# EAGLE design LED IoT Card (EAGLE 9.6.2)
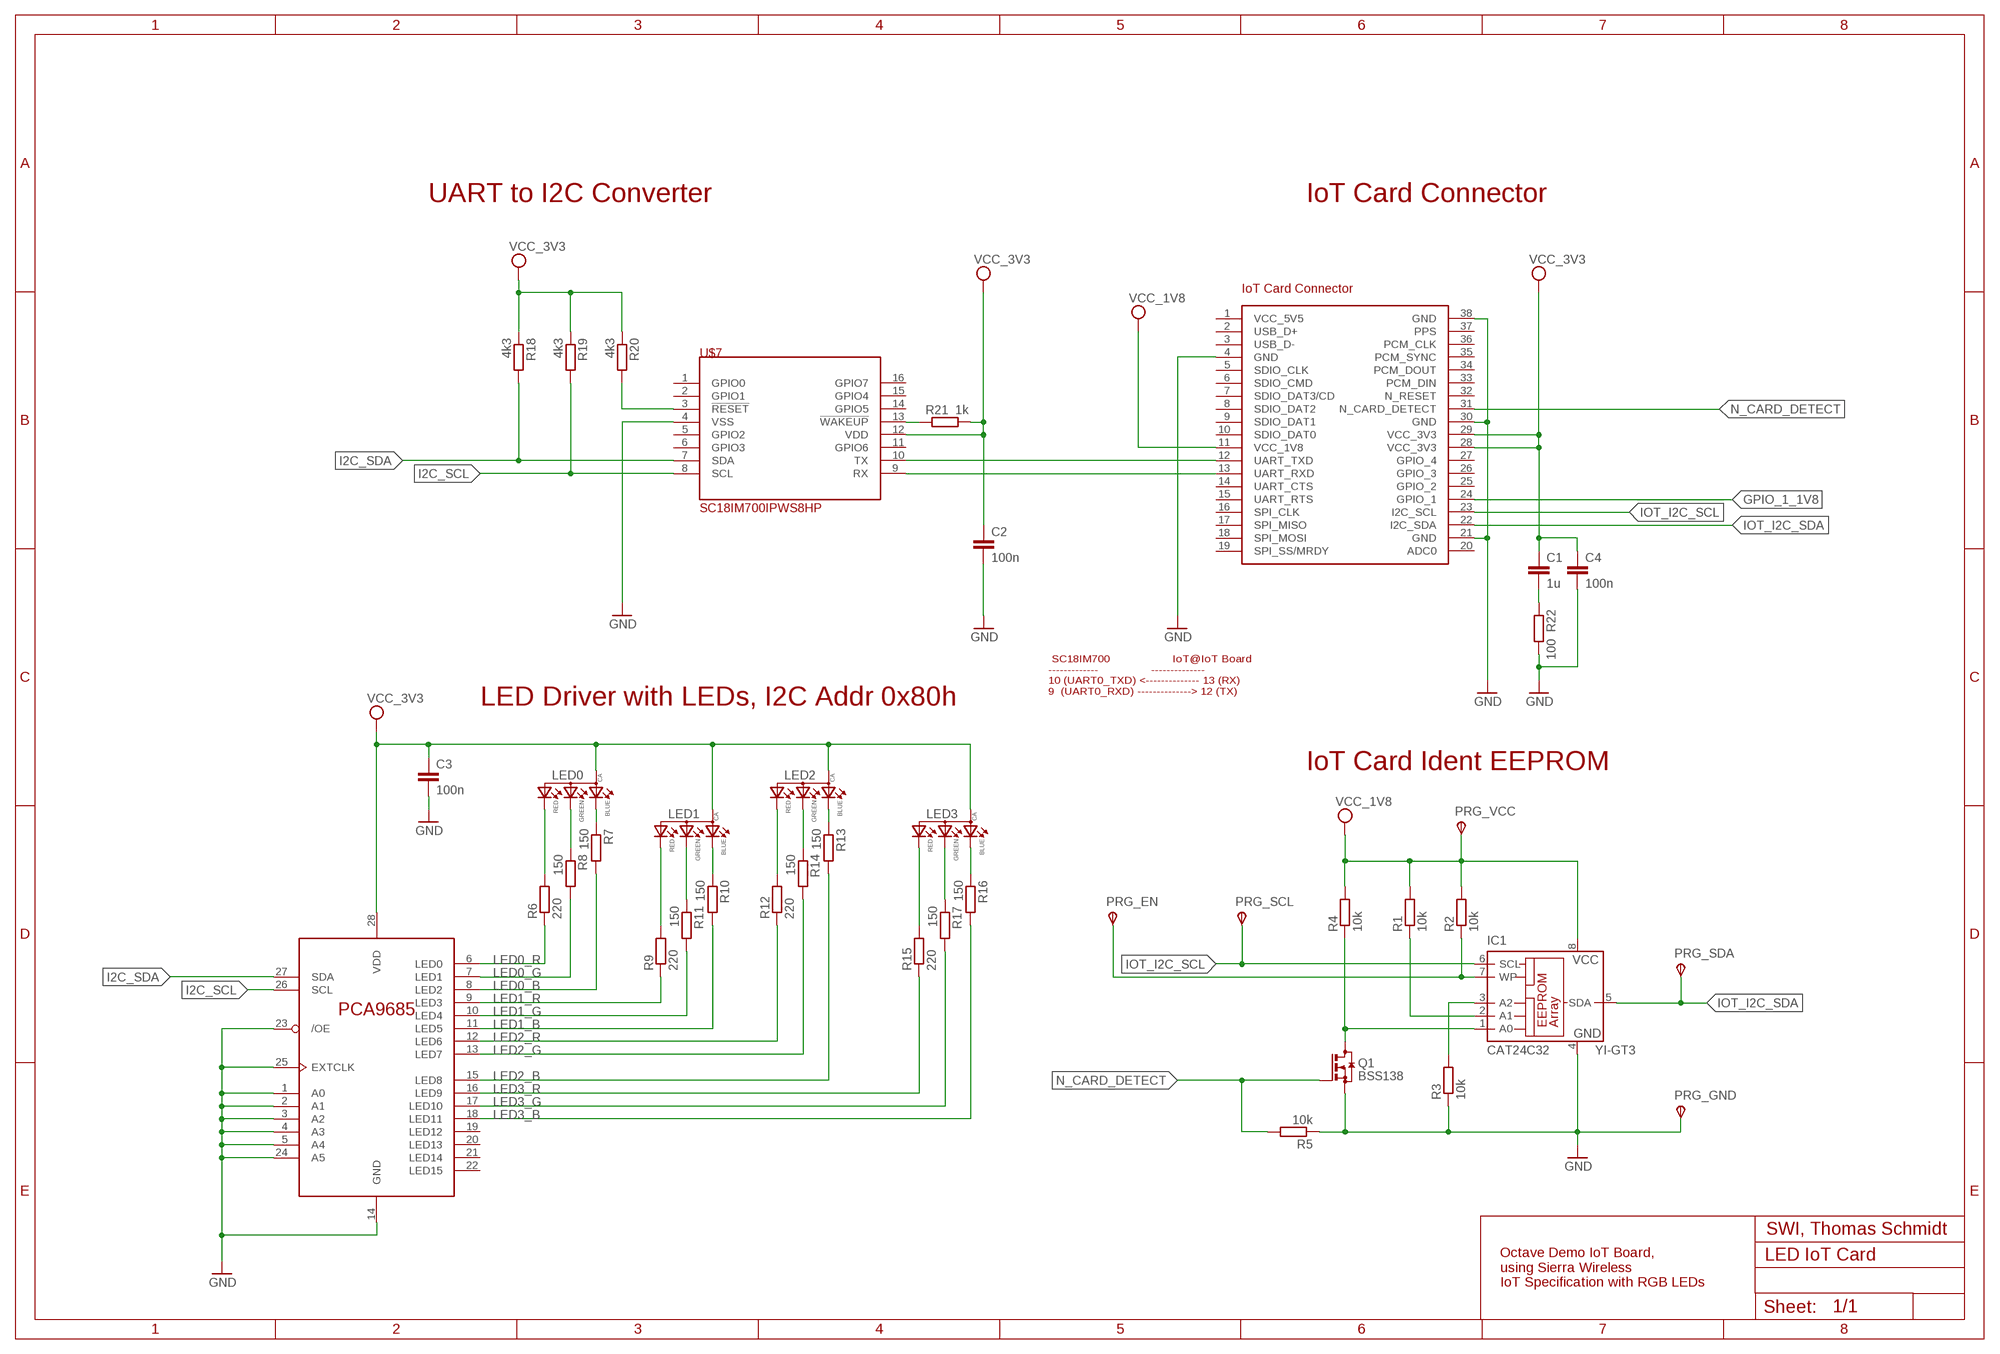
[diagram p0: schematic, sheet 1]

## Parts
C1  1u  C-EUC0805K  [C0805K]
C2  100n  C-EUC0603K  [C0603K]
C3  100n  C-EUC0603K  [C0603K]
C4  100n  C-EUC0603K  [C0603K]
IC1  CAT24C32 YI-GT3  24C64ST  [TSSOP8]
LED0  0.13_RGB_LEDPLCC  [P-LCC-4-3]
LED1  0.13_RGB_LEDPLCC  [P-LCC-4-3]
LED2  0.13_RGB_LEDPLCC  [P-LCC-4-3]
LED3  0.13_RGB_LEDPLCC  [P-LCC-4-3]
PRG_EN  TPSB1,27  [B1,27]
PRG_GND  TPSB1,27  [B1,27]
PRG_SCL  TPSB1,27  [B1,27]
PRG_SDA  TPSB1,27  [B1,27]
PRG_VCC  TPSB1,27  [B1,27]
Q1  BSS138  BSS123  [SOT23]
R1  10k  R-EU_R0402  [R0402]
R2  10k  R-EU_R0402  [R0402]
R3  10k  R-EU_R0402  [R0402]
R4  10k  R-EU_R0402  [R0402]
R5  10k  R-EU_R0402  [R0402]
R6  220  R-EU_R0402  [R0402]
R7  150  R-EU_R0402  [R0402]
R8  150  R-EU_R0402  [R0402]
R9  220  R-EU_R0402  [R0402]
R10  150  R-EU_R0402  [R0402]
R11  150  R-EU_R0402  [R0402]
R12  220  R-EU_R0402  [R0402]
R13  150  R-EU_R0402  [R0402]
R14  150  R-EU_R0402  [R0402]
R15  220  R-EU_R0402  [R0402]
R16  150  R-EU_R0402  [R0402]
R17  150  R-EU_R0402  [R0402]
R18  4k3  R-EU_R0402  [R0402]
R19  4k3  R-EU_R0402  [R0402]
R20  4k3  R-EU_R0402  [R0402]
R21  1k  R-EU_R0402  [R0402]
R22  100  R-EU_R0402  [R0402]
U$1  IOTLONG  [IOT_LONG]
U$2  PCA9685PW  [TSSOP28]
U$7  SC18IM700IPWS8HP  [TSSOP16]

## Nets
EEPROM_A0: IC1.1(A0) Q1.3(D) R4.1
EEPROM_A1: IC1.2(A1) R1.1
EEPROM_A2: IC1.3(A2) R3.2
EEPROM_WP: IC1.7(WP) PRG_EN.TP(PP) R2.1
GND: C2.2 C3.2 C4.2 IC1.4(GND) PRG_GND.TP(PP) Q1.2(S) R3.1 R5.1 R22.2 U$1.4(GND) U$1.21(GND) U$1.30(GND) U$1.38(GND) U$2.1(A0) U$2.2(A1) U$2.3(A2) U$2.4(A3) U$2.5(A4) U$2.14(GND) U$2.23(/OE) U$2.24(A5) U$2.25(EXTCLK) U$7.4(VSS)
GPIO_1_1V8: U$1.24(GPIO_1)
I2C_SCL: R19.2 U$2.26(SCL) U$7.8(SCL)
I2C_SDA: R18.2 U$2.27(SDA) U$7.7(SDA)
IOT_I2C_SCL: IC1.6(SCL) PRG_SCL.TP(PP) U$1.23(I2C_SCL)
IOT_I2C_SDA: IC1.5(SDA) PRG_SDA.TP(PP) U$1.22(I2C_SDA)
LED0_B: R7.2 U$2.8(LED2)
LED0_G: R8.2 U$2.7(LED1)
LED0_R: R6.1 U$2.6(LED0)
LED1_B: R10.2 U$2.11(LED5)
LED1_G: R11.2 U$2.10(LED4)
LED1_R: R9.1 U$2.9(LED3)
LED2_B: R13.2 U$2.15(LED8)
LED2_G: R14.2 U$2.13(LED7)
LED2_R: R12.1 U$2.12(LED6)
LED3_B: R16.2 U$2.18(LED11)
LED3_G: R17.2 U$2.17(LED10)
LED3_R: R15.1 U$2.16(LED9)
N$25: R20.2 U$7.3(!RESET)
N$26: R21.1 U$7.13(!WAKEUP)
N$27: C1.2 R22.1
N_CARD_DETECT: Q1.1(G) R5.2 U$1.31(N_CARD_DETECT)
RES_LED0_B: LED0.3(BLUE) R7.1
RES_LED0_G: LED0.2(GREEN) R8.1
RES_LED0_R: LED0.1(RED) R6.2
RES_LED1_B: LED1.3(BLUE) R10.1
RES_LED1_G: LED1.2(GREEN) R11.1
RES_LED1_R: LED1.1(RED) R9.2
RES_LED2_B: LED2.3(BLUE) R13.1
RES_LED2_G: LED2.2(GREEN) R14.1
RES_LED2_R: LED2.1(RED) R12.2
RES_LED3_B: LED3.3(BLUE) R16.1
RES_LED3_G: LED3.2(GREEN) R17.1
RES_LED3_R: LED3.1(RED) R15.2
SC18IM-RX_IOT-TX: U$1.12(UART_TXD) U$7.10(TX)
SC18IM-TX_IOT-RX: U$1.13(UART_RXD) U$7.9(RX)
VCC_1V8: IC1.8(VCC) PRG_VCC.TP(PP) R1.2 R2.2 R4.2 U$1.11(VCC_1V8)
VCC_3V3: C1.1 C2.1 C3.1 C4.1 LED0.4(ANODE) LED1.4(ANODE) LED2.4(ANODE) LED3.4(ANODE) R18.1 R19.1 R20.1 R21.2 U$1.28(VCC_3V3) U$1.29(VCC_3V3) U$2.28(VDD) U$7.12(VDD)
Unconnected: U$1.2(USB_D+) U$1.3(USB_D-) U$1.5(SDIO_CLK) U$1.6(SDIO_CMD) U$1.7(SDIO_DAT3/CD) U$1.8(SDIO_DAT2) U$1.9(SDIO_DAT1) U$1.10(SDIO_DAT0) U$1.14(UART_CTS) U$1.15(UART_RTS) U$1.16(SPI_CLK) U$1.17(SPI_MISO) U$1.18(SPI_MOSI) U$1.19(SPI_SS/MRDY) U$1.20(ADC0) U$1.25(GPIO_2) U$1.26(GPIO_3) U$1.27(GPIO_4) U$1.32(N_RESET) U$1.33(PCM_DIN) U$1.34(PCM_DOUT) U$1.35(PCM_SYNC) U$1.36(PCM_CLK) U$1.37(PPS) U$2.19(LED12) U$2.20(LED13) U$2.21(LED14) U$2.22(LED15) U$7.1(GPIO0) U$7.2(GPIO1) U$7.5(GPIO2) U$7.6(GPIO3) U$7.11(GPIO6) U$7.14(GPIO5) U$7.15(GPIO4) U$7.16(GPIO7)

## Notes on the sheet
- UART to I2C Converter | IoT Card Connector
- LED Driver with LEDs, I2C Addr 0x80h
- SC18IM700                   IoT@IoT Board
  -------------                --------------
  10 (UART0_TXD) <-------------- 13 (RX)  
  9  (UART0_RXD) --------------> 12 (TX)
- IoT Card Ident EEPROM
- SWI, Thomas Schmidt
- Octave Demo IoT Board, 
  using Sierra Wireless 
  IoT Specification with RGB LEDs

## Power pins joined to a net without a drawn wire
VCC_5V5: U$1.1(VCC_5V5)

## Library data of the parts
C1-C4 = rcl:C-EU: CAPACITOR, European symbol
IC1 = microchip:24*: Serial EEPROM I2C; MPN: CAT24C64YI-GT3; OC_FARNELL: 1718133; OC_NEWARK: 08R5418
LED0 LED1-LED3 = LEDs:0.13_RGB_LED: Everlight Red/Green/Blue LED 67-23/R6GHBHC-B01/2T || 67-23/R6GHBH-B01 Size 3.2*2.8*1.9mm Mounting Type SMD Full-Color LED PLCC4 Emitting Color Red/Green/Blue (620-625/530-535/470-475 nm) Chip Material AlGaInP/InGaN/InGaN Luminous Intensity 57-112/225-450/36-72 mcd Viewing Angle 120 deg Lens Type-Color Water Clear Forward Voltage 2.0/3.5/3.5 V Forward Current 10 mA Maximum Forward Voltage 2.4/3.9/3.9 V Maximum Forward Current 25/25/25 mA Min-Max Operating Temperature -40C to +85C Factory Pack 2000 pcs-Reel RoHS ✓; PROD_ID: DIO-12986
PRG_EN PRG_GND PRG_SCL PRG_SDA PRG_VCC = testpad:TPS: TEST PIN
Q1 = transistor-small-signal:BSS123: N-CHANNEL MOS FET
R1-R22 = rcl:R-EU_: RESISTOR, European symbol
U$1 = IoT Card:IOT: IoT Expansion Card The IoT Expansion Card form factor represents an open hardware standard for sensors, network adapters, and other IoT technologies that can be "plugged" into host applications (e.g. hardware development board) to provide new features and interfaces. As a family, IoT Expansion Cards share a standardized footprint and pinout, with several interfaces to support various IoT technologies. Please check as well: http://mangoh.io/uploaded-documents/Reference/IoT%20Cards/IoT%20Card%20Specification/4117166_IoT%20Expansion%20Card%20Design%20Specification_r8.pdf
U$2 = i2c-led-controller:PCA9685
U$7 = SC18IM700IPW:SC18IM700IPW

## Board
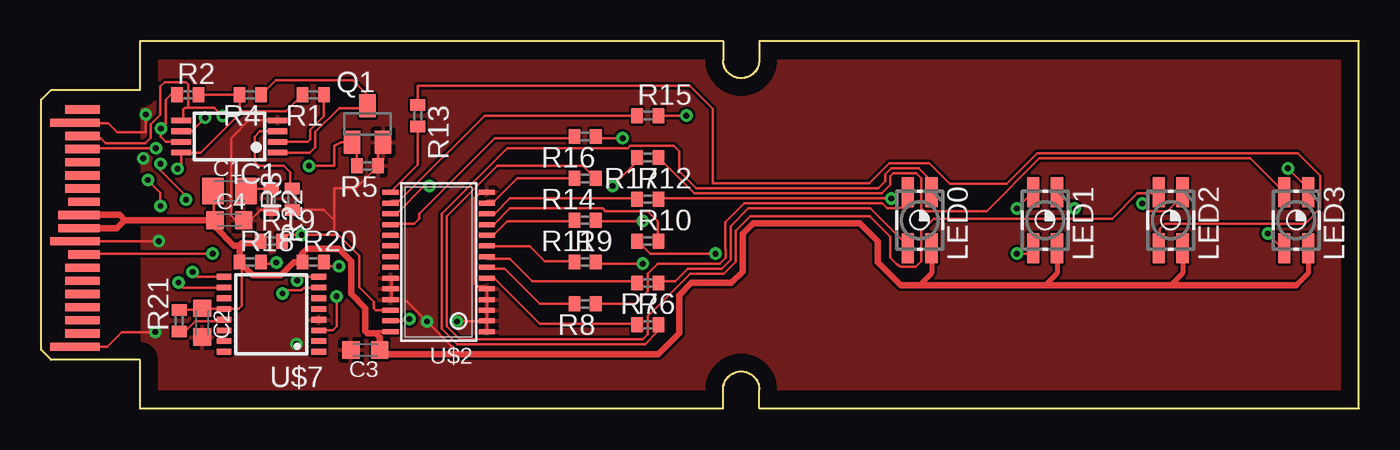
[diagram p1: board, top side]
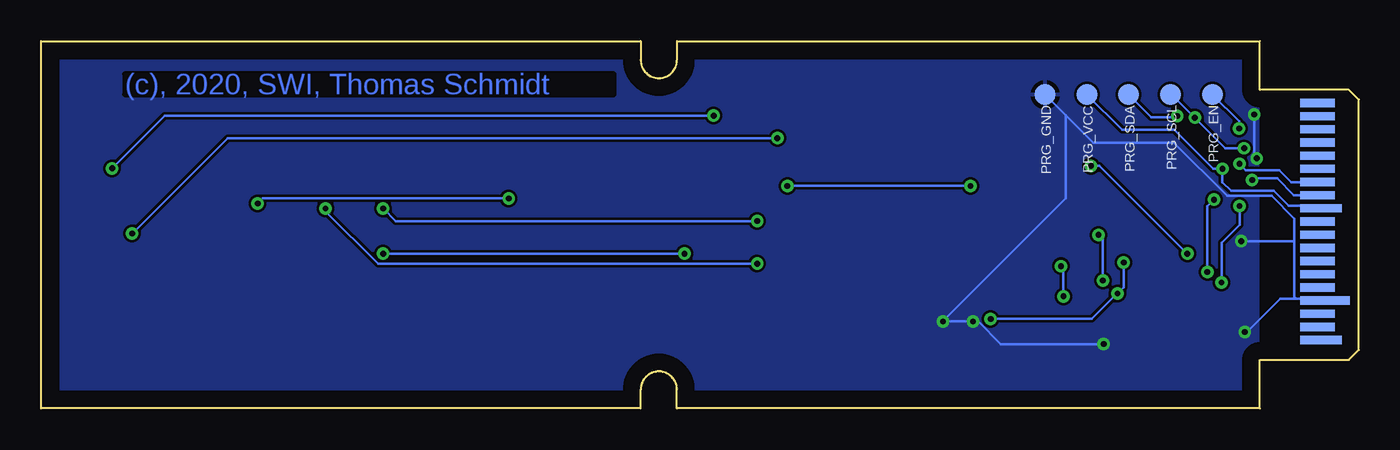
[diagram p2: board, bottom side, seen from below]

Size 80 x 22.3 mm. Coordinates in mm from the lower left corner, seen from the top.
Copper layers (1*16): Top 0.035mm / dielectric 1.5mm / Bottom 0.035mm
Design rules "default": minimum track width 6mil, minimum drill 0.35mm, track to track 6mil, track to pad 6mil, pad to pad 6mil, via to via 6mil, smd to smd 6mil, copper to edge 40mil, drill to drill 6mil, minimum pad ring 10mil, minimum via ring 8mil, stop-mask expansion 4mil, vias tented up to drill 0mil, thermal gap 10mil
tKeepout: area 6.1,20.3 to 41.1,22.3; area 6.1,0.3 to 41.1,2.3

### Footprints (pad centres in the part's own frame; a part is rotated, then mirrored left to right if it is on the bottom)
C0805K = smd 1.3 x 1.6: 1 -1,0; 2 1,0
C0603K = smd 1.05 x 1.08: 1 -0.875,0; 2 0.875,0
TSSOP8 = smd 0.35 x 1.2: 1 -0.975,-2.925; 2 -0.325,-2.925; 3 0.325,-2.925; 4 0.975,-2.925; 5 0.975,2.925; 6 0.325,2.925; 7 -0.325,2.925; 8 -0.975,2.925
P-LCC-4-3 = smd 0.75 x 1.8: 1 0.725,1.7; 2 -0.725,1.7; 3 -0.725,-1.7; 4 0.725,-1.7
B1,27 = smd 1.27 x 1.27: TP 0,0
SOT23 = smd 1 x 1.4: 1 -0.95,-1.1; 2 0.95,-1.1; 3 0,1.1
R0402 = smd 0.7 x 0.9: 1 -0.65,0; 2 0.65,0
IOT_LONG = smd 2.5 x 0.5 bottom: 1 2.3,4.15; 11 2.3,12.15 | smd 2.1 x 0.5 bottom: 2 2.5,4.95; 3 2.5,5.75; 5 2.5,7.35; 6 2.5,8.15; 7 2.5,8.95; 8 2.5,9.75; 9 2.5,10.55; 10 2.5,11.35; 12 2.5,12.95; 13 2.5,13.75; 14 2.5,14.55; 15 2.5,15.35; 16 2.5,16.15; 17 2.5,16.95; 18 2.5,17.75; 19 2.5,18.55 | smd 3 x 0.5 bottom: 4 2.05,6.55 | smd 2.1 x 0.5: 20 2.5,18.15; 22 2.5,16.55; 23 2.5,15.75; 24 2.5,14.95; 25 2.5,14.15; 26 2.5,13.35; 32 2.5,8.55; 33 2.5,7.75; 34 2.5,6.95; 35 2.5,6.15; 36 2.5,5.35; 37 2.5,4.55 | smd 3 x 0.5: 21 2.05,17.35; 30 2.05,10.15; 38 2.05,3.75 | smd 1.9 x 0.5: 27 2.6,12.55; 31 2.6,9.35 | smd 2.5 x 0.5: 28 2.3,11.75; 29 2.3,10.95
TSSOP28 = smd 0.305 x 0.991: 1 -4.225,-2.918; 2 -3.575,-2.918; 3 -2.925,-2.918; 4 -2.275,-2.918; 5 -1.625,-2.918; 6 -0.975,-2.918; 7 -0.325,-2.918; 8 0.325,-2.918; 9 0.975,-2.918; 10 1.625,-2.918; 11 2.275,-2.918; 12 2.925,-2.918; 13 3.575,-2.918; 14 4.225,-2.918; 15 4.225,2.918; 16 3.575,2.918; 17 2.925,2.918; 18 2.275,2.918; 19 1.625,2.918; 20 0.975,2.918; 21 0.325,2.918; 22 -0.325,2.918; 23 -0.975,2.918; 24 -1.625,2.918; 25 -2.275,2.918; 26 -2.925,2.918; 27 -3.575,2.918; 28 -4.225,2.918
TSSOP16 = smd 0.9 x 0.35: 1 -2.875,2.275; 2 -2.875,1.625; 3 -2.875,0.975; 4 -2.875,0.325; 5 -2.875,-0.325; 6 -2.875,-0.975; 7 -2.875,-1.625; 8 -2.875,-2.275; 9 2.875,-2.275; 10 2.875,-1.625; 11 2.875,-0.975; 12 2.875,-0.325; 13 2.875,0.325; 14 2.875,0.975; 15 2.875,1.625; 16 2.875,2.275

### Placement (x,y rotation side)
C1  11.43,13.21 0 top
C2  9.78,5.21 270 top
C3  19.69,3.56 180 top
C4  11.43,11.43 0 top
IC1  11.43,16.51 90 top
LED0  53.34,11.43 0 top
LED1  60.96,11.43 0 top
LED2  68.58,11.43 0 top
LED3  76.2,11.43 0 top
PRG_EN  8.89,19.05 0 bottom
PRG_GND  19.05,19.06 0 bottom
PRG_SCL  11.43,19.05 0 bottom
PRG_SDA  13.97,19.05 0 bottom
PRG_VCC  16.5,19.05 0 bottom
Q1  19.81,17.27 0 top
R1  16.51,19.05 180 top
R2  8.89,19.05 0 top
R3  15.24,12.7 90 top
R4  12.7,19.05 180 top
R5  19.81,14.73 180 top
R6  36.83,5.08 0 top
R7  36.83,7.62 180 top
R8  33.02,6.35 180 top
R9  33.02,8.89 0 top
R10  36.83,10.16 0 top
R11  33.02,11.43 180 top
R12  36.83,12.7 0 top
R13  22.86,17.78 270 top
R14  33.02,13.97 180 top
R15  36.83,17.78 0 top
R16  33.02,16.51 180 top
R17  36.83,15.24 180 top
R18  12.7,8.89 0 top
R19  13.97,10.16 0 top
R20  16.51,8.89 0 top
R21  8.38,5.33 90 top
R22  13.97,12.7 270 top
U$1  0,0 0 top
U$2  24.13,8.89 90 top
U$7  13.97,5.71 180 top

### Tracks (layer width: path | path; a pad name or v marks a point on that pad's centre or on a via)
EEPROM_A0
  Top 0.152: IC1.1 16.3,15.54 16.64,15.88 16.64,16.79 18.09,18.24 19.81,18.24 Q1.3 19.81,19.05 18.93,19.93 14.23,19.93 R4.1
EEPROM_A1
  Top 0.152: IC1.2 16.19,16.19 16.33,16.33 16.33,16.92 17.16,17.74 R1.1
EEPROM_A2
  Top 0.152: R3.2 15.11,13.48 15.11,14.35 14.73,14.73 13.21,14.73 12.95,14.99 12.95,16.51 13.28,16.84 IC1.3
EEPROM_WP  (via drill 0.35)
  Top 0.152: R2.1 7.87,19.05 7.57,18.75 7.57,17.3 v7.26,16.99 7.26,16.48 7.56,16.19 IC1.7
  Bottom 0.152: v7.26,16.99 7.26,17.42 PRG_EN.TP
GND  (via drill 0.35)
  Top 0.152: U$2.25 21.29,6.66 21.29,7.26 U$2.24 21.29,7.42 21.29,7.87 U$2.23 21.2,7.9 20.8,7.9 | 22.2,6.5 v23.42,5.28 24.94,3.76 | U$1.21 2.08,17.32 4.06,17.32 4.62,16.76 6.35,16.76 v6.35,17.85 | 17.78,11.43 17.78,13.36 19.09,13.36 R5.1 20.46,15.87 Q1.2 | 17.78,11.43 17.78,10.92 | U$2.1 27.08,4.67 27.08,5.28 U$2.2 | U$2.2 27.08,5.44 27.08,5.89 U$2.3 27.08,6.05 27.08,6.5 U$2.4 27.08,6.66 27.08,7.26 U$2.5 26.92,7.42 26.47,7.42 26.31,7.57 26.31,12.75 26.62,13.06 26.92,13.06 U$2.14 | 15.63,3.78 v15.49,3.91 15.65,3.91 | v7.14,10.16 2.08,10.16 U$1.30 | v25.25,5.28 26.92,5.28 U$2.2 | v6.93,4.64 4.89,4.64 4,3.75 U$1.38 | R22.2 13.32,12.05 12.7,11.43 12.46,11.43 12.27,11.62 C4.2 11.81,11.43 11.53,11.71 11.53,16.41 12.61,17.48 IC1.4 | R3.1 17.16,12.05 17.78,11.43
  Bottom 0.152: 3.91,10.16 3.91,6.76 3.81,6.66 | 3.91,10.16 3.91,11.53 5.28,12.9 8,12.9 11.24,16.14 16.13,16.14 PRG_GND.TP 17.78,17.79 17.78,12.75 v25.25,5.28 v23.42,5.28 23.11,5.28 21.74,3.91 v15.49,3.91 | 3.81,6.66 2.08,6.66 U$1.4 | 3.91,10.16 v7.14,10.16 | v6.35,17.85 6.35,15.34 v6.2,15.19 | v6.93,4.64 6.79,4.64 4.78,6.66 3.81,6.66
  pour Top: 6.12,21.5 6.12,0.3 79.12,0.3 79.12,21.5
  pour Bottom: 6.12,21.5 6.12,0.3 79.12,0.3 79.12,21.5
I2C_SCL  (via drill 0.35)
  Top 0.152: R19.2 15,10.54 v15.8,10.54 18.03,10.54 19.3,9.27 19.3,7.37 20.19,6.48 20.19,6.1 20.32,5.96 U$2.26 | v15.55,7.77 15.76,7.99 U$7.8
  Bottom 0.152: v15.8,10.54 15.55,10.29 v15.55,7.77
I2C_SDA  (via drill 0.35)
  Top 0.152: v14.28,8.87 14.2,8.79 13.36,8.79 R18.2 | U$2.27 22.23,5.32 v22.35,5.44 | U$7.7 15.97,7.34 15.8,7.17 14.84,7.17 v14.66,6.98
  Bottom 0.152: v14.28,8.87 14.28,7.37 v14.66,6.98 16.21,5.44 v22.35,5.44
IOT_I2C_SCL  (via drill 0.35)
  Top 0.152: v6.96,15.8 2.54,15.8 U$1.23 | v9.96,17.65 9.14,16.84 IC1.6
  Bottom 0.152: v6.96,15.8 8.1,15.8 v9.96,17.65 11.35,19.05 PRG_SCL.TP
IOT_I2C_SDA  (via drill 0.35)
  Top 0.152: U$1.22 2.54,16.41 3.61,16.41 3.91,16.1 6.33,16.1 6.66,16.44 6.66,17.24 7.24,17.82 7.24,19.56 7.49,19.81 8.81,19.81 8.94,19.68 8.94,18.31 8.89,18.26 | v11.02,17.75 10.52,18.26 8.89,18.26 | IC1.5 8.63,17.61 8.63,18.16 8.74,18.26 8.89,18.26
  Bottom 0.152: PRG_SDA.TP 12.6,17.68 11.1,17.68 v11.02,17.75
LED0_B
  Top 0.152: R7.2 36.07,7.72 29.82,7.72 28.45,9.09 27.08,9.09 U$2.8
LED0_G
  Top 0.152: R8.2 30.28,6.35 28.14,8.48 27.08,8.48 U$2.7
LED0_R
  Top 0.152: R6.1 36.07,5.13 30.28,5.13 27.53,7.87 27.08,7.87 U$2.6
LED1_B
  Top 0.152: R10.2 37.44,10.16 37.44,11.38 36.83,11.99 34.24,11.99 34.09,12.14 28.45,12.14 27.53,11.23 27.08,11.23 U$2.11
LED1_G
  Top 0.152: R11.2 32.26,11.38 28.3,11.38 27.53,10.62 27.08,10.62 U$2.10
LED1_R
  Top 0.152: R9.1 32.26,8.94 30.58,8.94 29.67,9.86 27.08,9.86 U$2.9
LED2_B
  Top 0.152: R13.2 22.86,14.78 21.29,13.21 U$2.15
LED2_G
  Top 0.152: R14.2 28.91,13.97 27.53,12.6 27.08,12.6 U$2.13
LED2_R
  Top 0.152: R12.1 36.07,12.75 28.45,12.75 27.53,11.84 27.08,11.84 U$2.12
LED3_B
  Top 0.152: R16.2 32.26,16.41 27.53,16.41 22.96,11.84 22.96,11.53 22.66,11.23 21.29,11.23 U$2.18
LED3_G  (via drill 0.35)
  Top 0.152: v34.7,13.51 36.07,14.88 36.07,15.19 R17.2 | v23.57,13.51 23.27,13.51 21.59,11.84 21.29,11.84 U$2.17
  Bottom 0.152: v23.57,13.51 v34.7,13.51
LED3_R
  Top 0.152: R15.1 26.92,17.78 21.74,12.6 21.29,12.6 U$2.16
N$25  (via drill 0.35)
  Top 0.152: v18.09,8.64 17.32,8.64 17.17,8.79 R20.2 | U$7.3 17.69,4.74 17.93,4.98 v17.93,6.81
  Bottom 0.152: v17.93,6.81 17.93,8.48 v18.09,8.64
N$26
  Top 0.152: R21.1 8.74,4.68 9.34,5.28 10.83,5.28 10.86,5.27 10.95,5.28 11.05,5.28 11.07,5.31 11.1,5.31 11.14,5.36 U$7.13
N$27
  Top 0.152: R22.1 12.43,13.35 C1.2
N_CARD_DETECT  (via drill 0.35)
  Top 0.152: v16.26,14.73 17.78,14.73 17.78,15.95 18.2,16.17 Q1.1 19.16,15.87 R5.2 | v10.41,9.4 2.69,9.4 U$1.31
  Bottom 0.152: v10.41,9.4 15.75,14.73 v16.26,14.73
RES_LED0_B
  Top 0.152: R7.1 37.59,7.72 38.51,7.72 39.27,8.49 41.32,8.49 41.86,9.02 41.86,11.07 42.93,12.14 50.34,12.14 52.53,9.96 52.53,9.7 LED0.3
RES_LED0_G
  Top 0.152: R8.1 36.07,6.35 36.83,7.11 36.83,8.18 37.44,8.79 41.2,8.79 41.55,9.15 41.55,9.65 41.53,9.67 41.53,11.3 42.67,12.45 51.06,12.45 51.36,12.14 51.86,12.14 51.91,12.19 52.58,12.19 52.62,12.23 LED0.2
RES_LED0_R
  Top 0.152: R6.2 37.44,4.98 37.44,4.67 36.68,3.91 25.25,3.91 24.33,4.83 24.33,11.84 28.3,15.8 35.61,15.8 35.76,15.95 38.41,15.95 38.74,15.62 38.74,14.42 39.78,13.37 50.83,13.37 51.26,13.79 51.26,14.22 51.61,14.58 53.29,14.58 54.05,13.82 54.05,13.21 LED0.1
RES_LED1_B  (via drill 0.35)
  Top 0.152: v40.95,9.4 36.98,9.4 36.22,10.16 R10.1 | v59.23,9.4 59.84,9.4 60.15,9.7 LED1.3
  Bottom 0.152: v59.23,9.4 v40.95,9.4
RES_LED1_G  (via drill 0.35)
  Top 0.152: v36.53,11.38 33.78,11.38 R11.1 | v59.23,12.14 60.15,13.06 LED1.2
  Bottom 0.152: v36.53,11.38 58.47,11.38 v59.23,12.14
RES_LED1_R  (via drill 0.35)
  Top 0.152: v36.53,8.79 33.78,8.79 R9.2 | v62.74,12.14 61.82,13.06 LED1.1
  Bottom 0.152: v36.53,8.79 59.54,8.79 62.74,11.99 v62.74,12.14
RES_LED2_B
  Top 0.152: R13.1 22.86,19.61 39.37,19.61 40.77,18.21 40.77,13.67 50.28,13.67 51.49,14.88 53.91,14.88 55.15,13.64 58.62,13.64 60.48,15.49 76.3,15.49 77.67,14.12 77.67,12.14 76.76,11.23 68.25,11.23 67.92,10.9 67.92,9.7 LED2.3
RES_LED2_G
  Top 0.152: R14.1 33.63,13.97 32.87,14.73 27.69,14.73 24.64,11.68 24.64,4.98 25.4,4.22 36.53,4.22 36.83,4.52 36.83,5.59 39.42,8.18 41.45,8.18 42.16,8.89 42.16,10.79 43.05,11.68 50.29,11.68 51.56,10.41 51.56,9.14 51.94,8.76 51.98,8.76 52.15,8.6 53.1,8.6 53.44,8.94 53.44,10.77 54.2,11.53 65.02,11.53 66.55,13.06 67.77,13.06 LED2.2
RES_LED2_R  (via drill 0.35)
  Top 0.152: v51.61,12.75 37.59,12.75 R12.2 | v66.85,12.45 67.31,11.99 68.38,11.99 69.44,13.06 LED2.1
  Bottom 0.152: v51.61,12.75 66.55,12.75 v66.85,12.45
RES_LED3_B  (via drill 0.35)
  Top 0.152: v35.31,16.41 33.78,16.41 R16.1 | v74.47,10.62 75.39,9.7 LED3.3
  Bottom 0.152: v35.31,16.41 68.68,16.41 v74.47,10.62
RES_LED3_G
  Top 0.152: LED3.2 75.39,13.21 73.41,15.19 60.6,15.19 57.4,11.99 53.59,11.99 53.44,12.14 53.44,13.97 53.14,14.28 51.74,14.28 51.56,14.1 51.56,13.59 51.03,13.06 39.66,13.06 R17.1
RES_LED3_R  (via drill 0.35)
  Top 0.152: v39.17,17.78 R15.2 | v75.69,14.58 77.06,13.21 LED3.1
  Bottom 0.152: v39.17,17.78 72.49,17.78 v75.69,14.58
SC18IM-RX_IOT-TX  (via drill 0.35)
  Top 0.152: v7.24,12.29 7.24,13.11 v6.48,13.87 | U$7.10 8.64,7.34 v8.33,7.64
  Bottom 0.152: v7.24,12.29 7.24,11.15 8.33,10.06 v8.33,7.64 | U$1.12 2.54,13.06 3.33,13.06 3.43,12.95 3.94,12.95 4.95,13.97 6.58,13.97 v6.48,13.87
SC18IM-TX_IOT-RX  (via drill 0.35)
  Top 0.152: v8.79,12.68 8.79,12.93 7.24,14.48 v7.24,14.86 | U$7.9 9.49,7.99 v9.2,8.28
  Bottom 0.152: v9.2,8.28 9.2,12.27 v8.79,12.68 | U$1.13 4.1,13.75 4.83,14.48 6.86,14.48 v7.24,14.86
VCC_1V8  (via drill 0.35)
  Top 0.152: v8.28,14.55 8.51,14.78 IC1.8 9.69,15.54 12.05,17.89 12.05,18.03 | 12.05,18.03 R4.2 R2.2 | R1.2 14.84,18.03 12.05,18.03
  Bottom 0.152: U$1.11 2.39,12.29 4.24,12.29 5.16,13.21 7.75,13.21 8.28,13.74 v8.28,14.55 8.84,14.55 11.2,16.92 14.37,16.92 PRG_VCC.TP
VCC_3V3
  Top 0.152: C4.1 10.47,11.61 10.47,13.08 C1.1 | R21.2 9.68,5.98 C2.1 9.82,6.04 U$7.12 12.01,6.04 12.19,6.22 12.19,8.75 R18.1
  Top 0.2: U$2.28 20.41,4.66 20.32,4.57 | C3.1 20.83,3.56
  Top 0.305: LED0.4 54.07,8.22 53.34,7.49 | LED1.4 61.69,8.22 60.96,7.49 | LED2.4 69.31,8.22 68.58,7.49 | LED3.4 76.93,8.22 76.2,7.49
  Top 0.406: U$1.28 4.76,11.75 5.08,11.43 | 5.08,11.43 4.6,10.95 U$1.29 | R19.1 13.19,10.03 12.19,10.03 12.05,9.89 | 12.05,9.89 R18.1 12.64,8.3 12.64,8.29 12.85,8.08 14.53,8.08 15.34,8.89 R20.1 15.86,9.41 16.14,9.7 18.06,9.7 18.82,8.94 18.82,6.96 19.69,6.1 19.69,4.67 19.79,4.57 20.32,4.57 20.56,4.33 C3.1 | 5.08,11.43 C4.1 10.56,11.04 11.7,9.89 12.05,9.89 | 76.2,7.49 68.58,7.49 60.96,7.49 53.34,7.49 52.2,7.49 50.8,8.89 50.8,10.16 49.71,11.25 43.23,11.25 42.59,10.61 42.59,8.3 41.91,7.62 39.47,7.62 38.74,6.88 38.74,4.57 37.47,3.3 21.08,3.3 20.83,3.56

### Text on the board
Bottom: (c), 2020, SWI, Thomas Schmidt